# Altium schematic sheet Sheet3_Circuito.SchDoc: Teste
size A4; DocumentNumber: 1; SheetNumber: 1; SheetTotal: 1
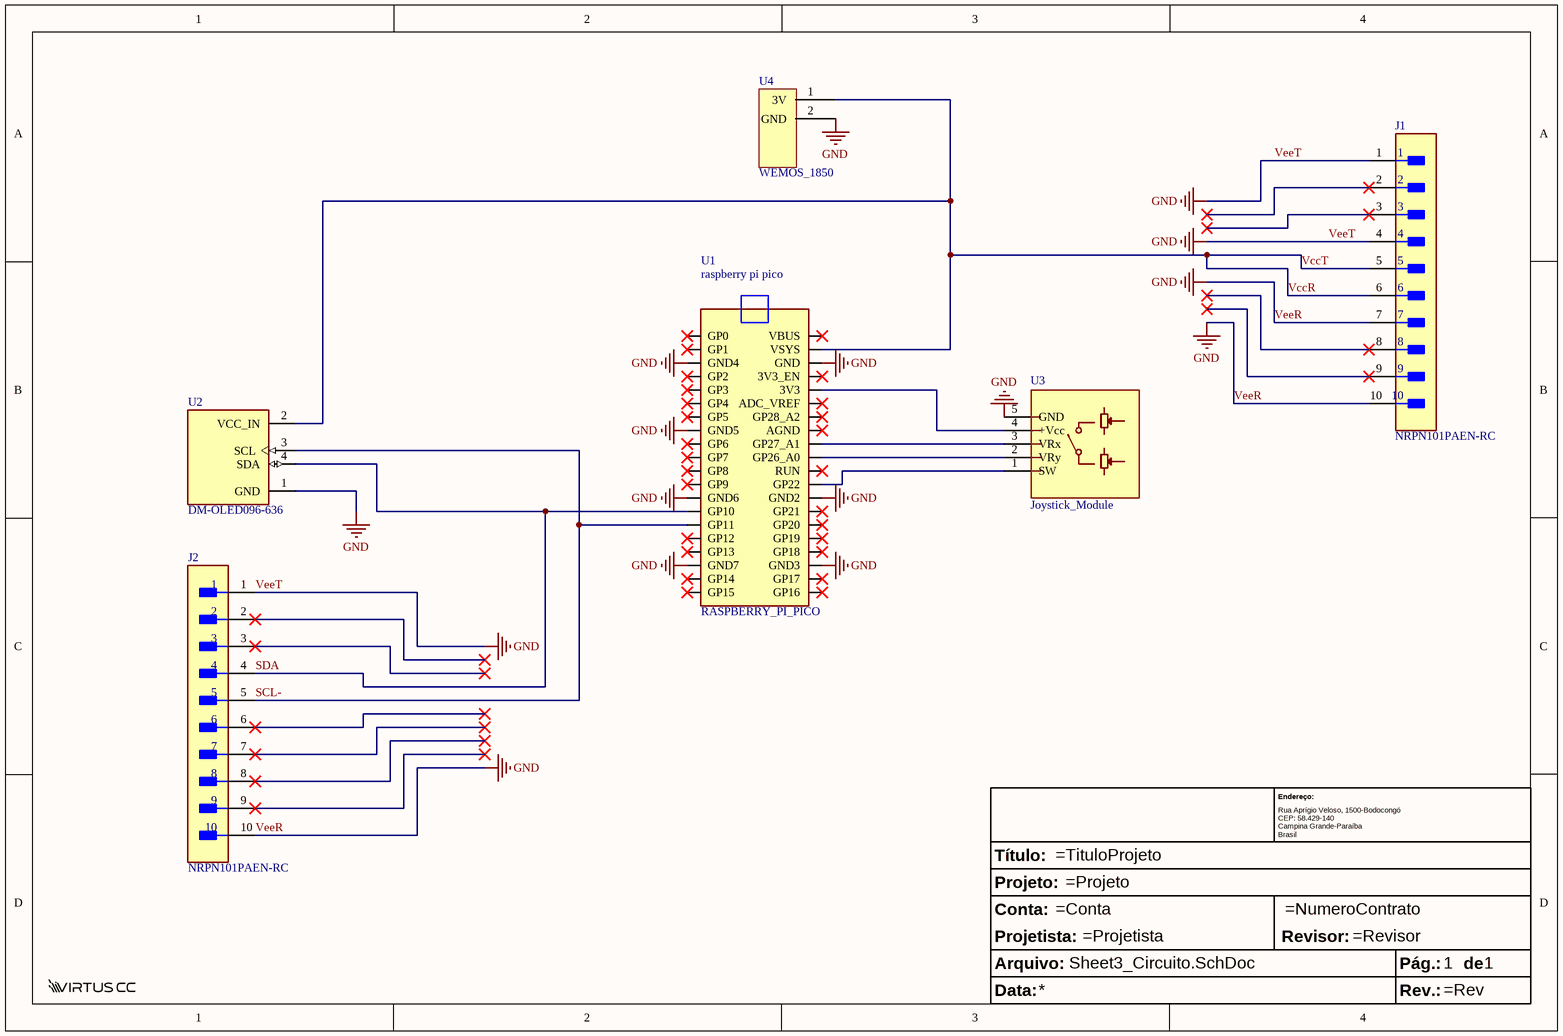
[diagram p0: Sheet3_Circuito.SchDoc]

## Parts
J1  NRPN101PAEN-RC  [FP-NRPN101PAEN-RC-MFG]
J2  NRPN101PAEN-RC  [FP-NRPN101PAEN-RC-MFG]
LG1  Logo Virtus  [Logo_VirtusCC]  (value not drawn)
TB?  Title Block  (value not drawn)  (graphical)
U1  RASPBERRY_PI_PICO  [RASPBERRY_PI_PICO]
U2  DM-OLED096-636  [MODULE_DM-OLED096-636]
U3  Joystick_Module  [JOYSTICK_MODULE]
U4  WEMOS_1850  [WEMOS_18650_BATTERY_SHIELD_V3]

## Nets
VeeR: J1.1 J1.4 J1.7 J1.10 J2.1 J2.10 U1.GND U1.GND2 U1.GND3 U1.GND4 U1.GND5 U1.GND6 U1.GND7 U2.1(GND) U3.5(GND) U4.2(GND)  [also labelled GND, VeeT]
SCL-: J2.5 U1.GP11 U2.3(SCL)
SDA: J2.4 U1.GP10 U2.4(SDA)
VccR: J1.5 J1.6 U1.VSYS U2.2(VCC_IN) U4.1(3V)  [also labelled VccT]
NetU1_3V3: U1.3V3 U3.4(+Vcc)
NetU1_GP22: U1.GP22 U3.1(SW)
NetU1_GP26_A0: U1.GP26_A0 U3.2(VRy)
NetU1_GP27_A1: U1.GP27_A1 U3.3(VRx)

Not connected (* = marked no-connect by the designer): J1 2* 3* 8* 9*; J2 2* 3* 6* 7* 8* 9*; U1 3V3_EN* ADC_VREF* AGND* GP0* GP1* GP2* GP3* GP4* GP5* GP6* GP7* GP8* GP9* GP12* GP13* GP14* GP15* GP16* GP17* GP18* GP19* GP20* GP21* GP28_A2* RUN* VBUS*

## Notes on the sheet
- (in symbol RASPBERRY_PI_PICO) raspberry pi pico
- (in symbol Title Block) Endereço:; Rua Aprígio Veloso, 1500-Bodocongó / CEP: 58.429-140 / Campina Grande-Paraíba / Brasil; Título:; Projeto:; Conta:; Projetista:; Revisor:; Arquivo:; Pág.:; de; Data:; Rev.:

## Library data of the parts
J1 J2 = CMP-25680-000006-1: CONN HEADER VERT 10POS 2MM; Manufacturer: Sullins; Current Rating: 2A; Conn Gender: Male; Voltage Rating: 150V; Conn Orientation: Straight; Number Of Contacts: 10; Temperature: -40°C to +105°C; Manufacturer Part Number: NRPN101PAEN-RC; Package: 0; Lead Free: Yes; Device Class L3: unset; Octopart: https://octopart.com/nrpn101paen-rc-sullins-18674398; Device Class L1: Connectors; Contact Material: Gold,Nickel; ComponentLink2URL: https://s3.amazonaws.com/catalogspreads-pdf/PAGE104-105%202mm%20MALE%20HDR%20ST%20RA%20SMT.pdf; Footprint Url: https://drawings-pdf.s3.amazonaws.com/10531.pdf; Height: 5.95mm; Digikey Description: CONN HEADER VERT 10POS 2MM; Category: Conn; Automotive: No; Number Of Rows: 1; Device Class L2: Headers and Wire Housings; Temperature Range High: +105°C; Temperature Range Low: -40°C; Pitch: 2mm; RoHS: TRUE; ComponentLink2Description: Datasheet
LG1 = Logo_Virtus_cc
U1 = RASPBERRY_PI_PICO: Raspberry Pi Board, Arm Cortex-M0+; Core Architecture:Arm; Core Sub-Architecture:Cortex-M0+; Kit Contents:Raspberry Pi Pico Board; No. Of Bits:32Bit; Silicon Core Number:Rp2040; Silicon Manufacturer:Raspberry Pi |Raspberry-Pi RASPBERRY PI PICO; SnapEDA_Link: https://www.snapeda.com/parts/RASPBERRY%20PI%20PICO/Raspberry+Pi/view-part/?ref=snap; Package: None; Value: *; MF: Raspberry Pi; MP: RASPBERRY PI PICO; Check_prices: https://www.snapeda.com/parts/RASPBERRY%20PI%20PICO/Raspberry+Pi/view-part/?ref=eda
U2 = DM-OLED096-636: 0.96â€ 128 X 64 MONOCHROME GRAPHIC OLED DISPLAY MODULE - I2C; SnapEDA_Link: https://www.snapeda.com/parts/DM-OLED096-636/Display+Module/view-part/?ref=snap; Package: Package; Value: *; MF: Display Module; MP: DM-OLED096-636; Check_prices: https://www.snapeda.com/parts/DM-OLED096-636/Display+Module/view-part/?ref=eda